# EAGLE design balise (EAGLE 8.6.0)
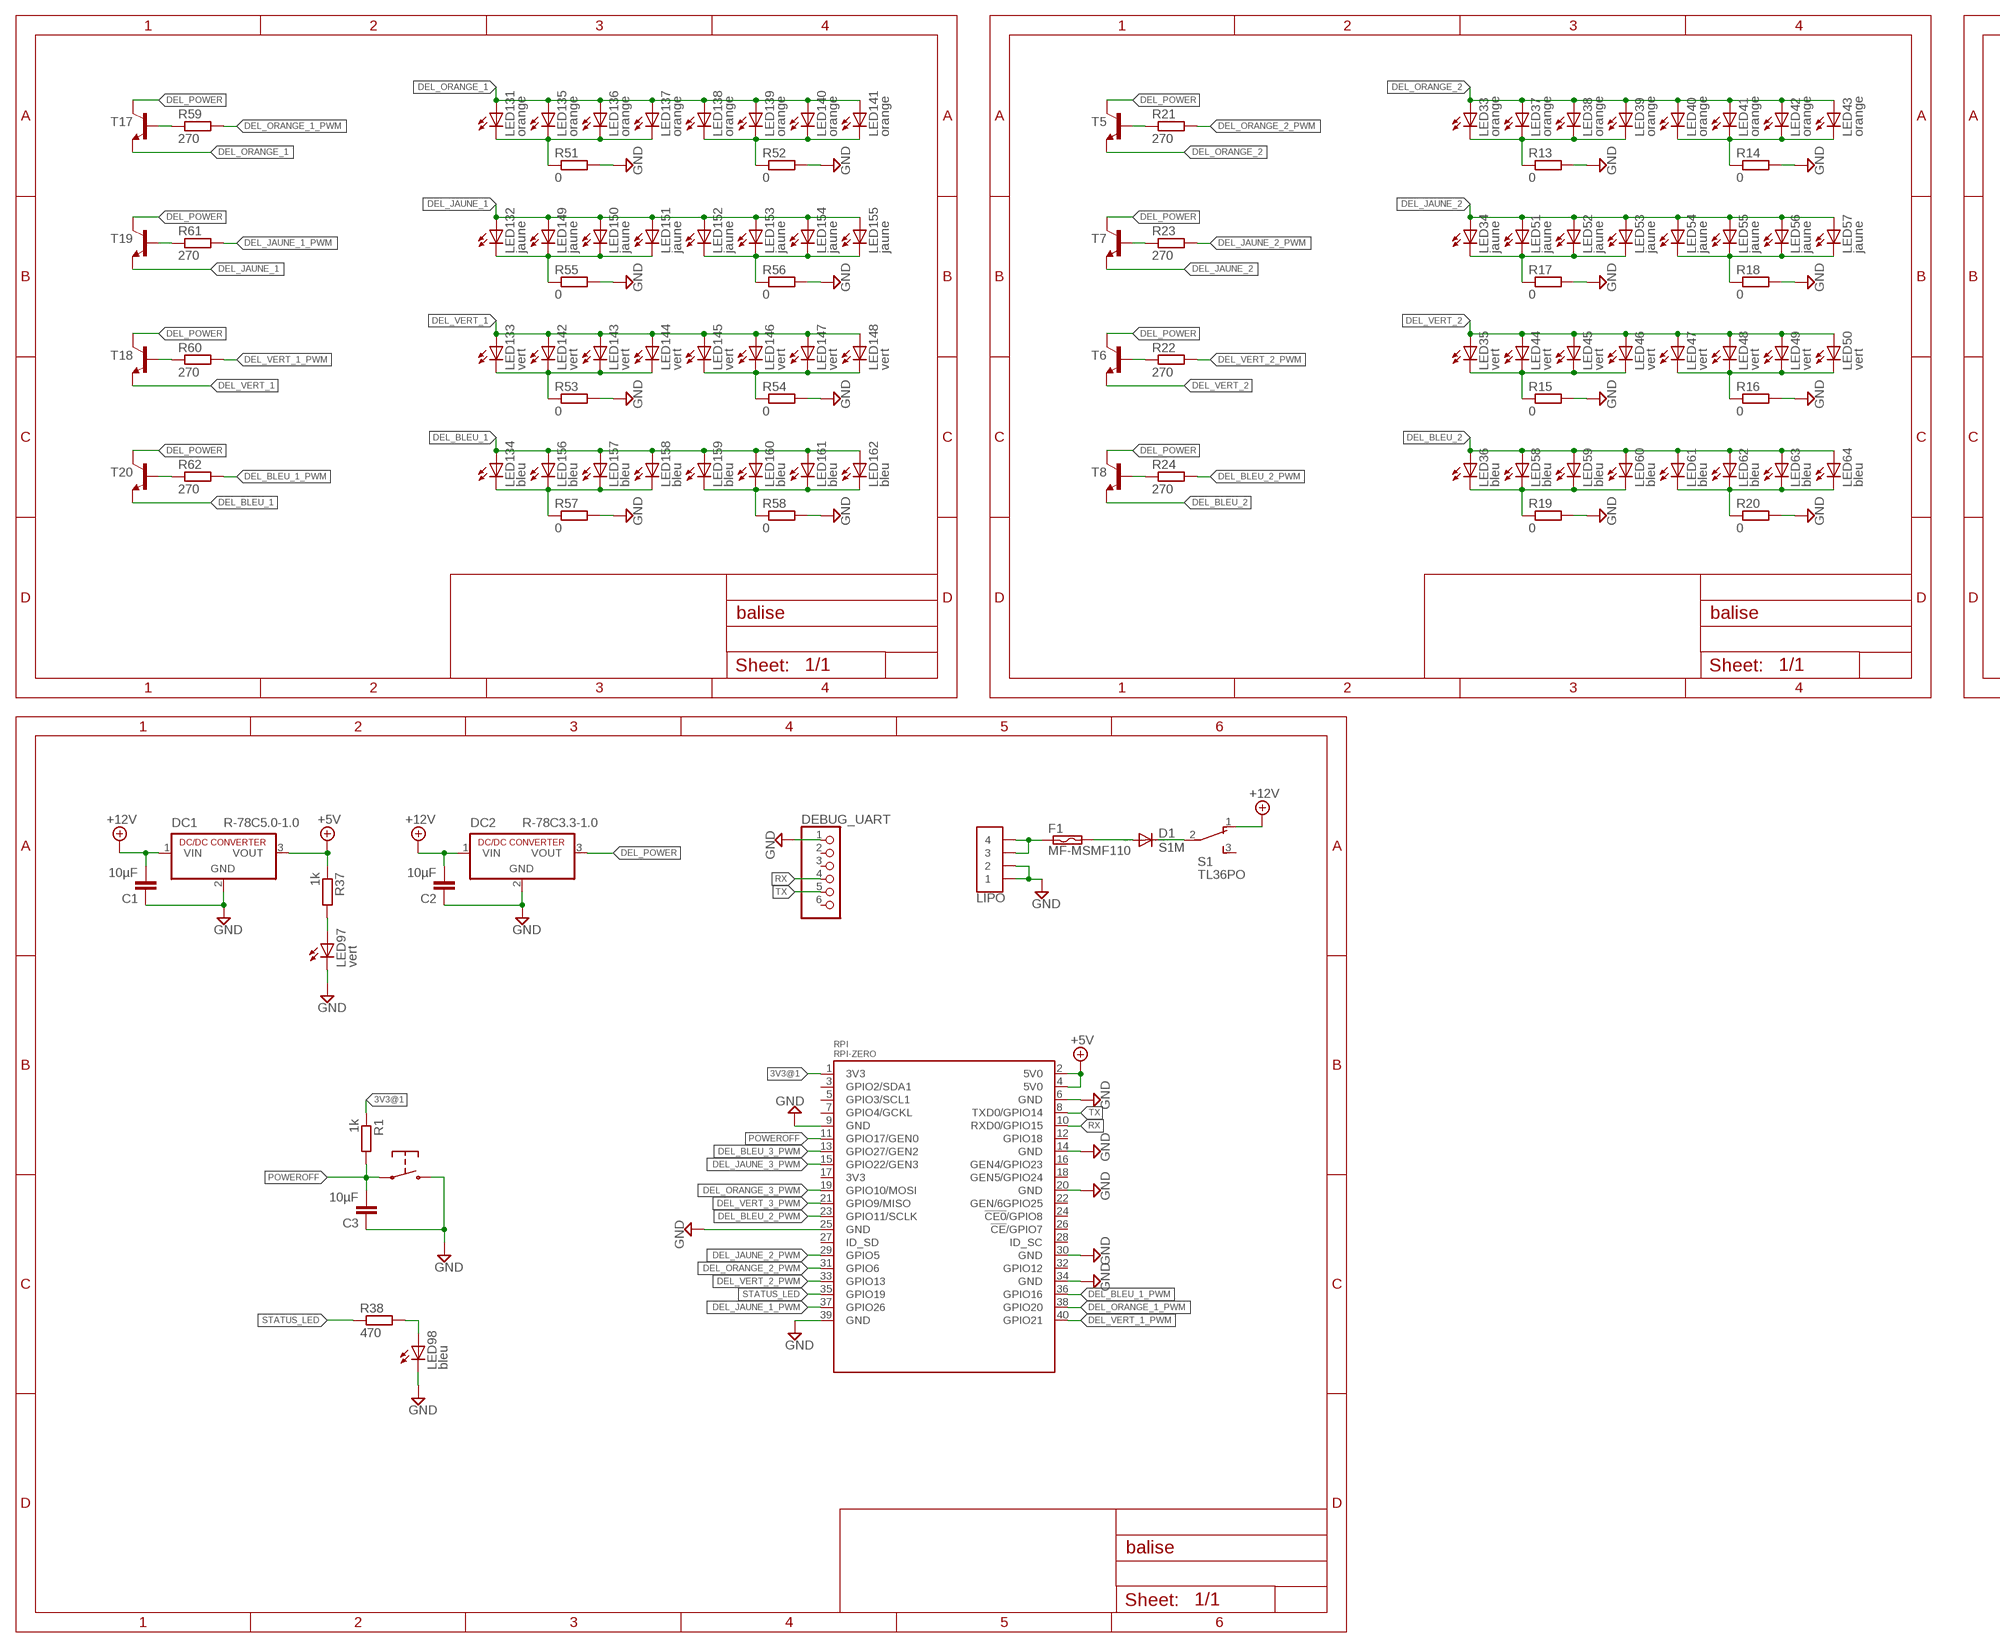
[diagram p0: schematic, sheet 1, part 1 of 2]
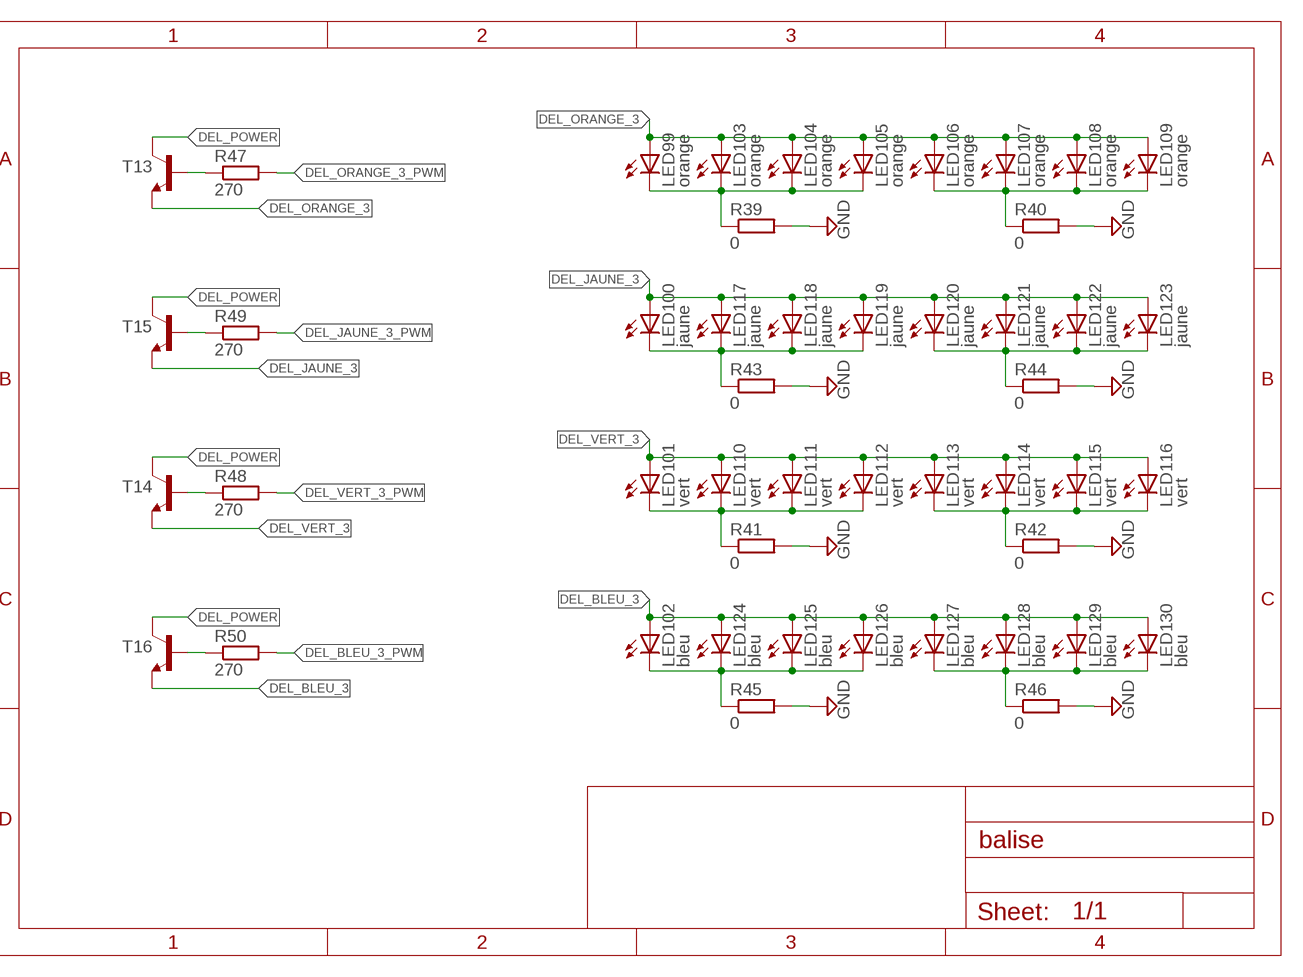
[diagram p1: schematic, sheet 1, part 2 of 2]

## Parts
C1  10µF  C-EUC0805  [C0805]
C2  10µF  C-EUC0805  [C0805]
C3  10µF  C-EUC0805  [C0805]
D1  S1M  [SMA]
DC1  R-78C5.0-1.0  [SIP3]
DC2  R-78C3.3-1.0  [SIP3]
DEBUG_UART  PINHD-1X6  [1X06]
F1  MF-MSMF110  [MF-MSMF110]
LED33  orange  LED5MM  [LED5MM]
LED34  jaune  LED5MM  [LED5MM]
LED35  vert  LED5MM  [LED5MM]
LED36  bleu  LED5MM  [LED5MM]
LED37  orange  LED5MM  [LED5MM]
LED38  orange  LED5MM  [LED5MM]
LED39  orange  LED5MM  [LED5MM]
LED40  orange  LED5MM  [LED5MM]
LED41  orange  LED5MM  [LED5MM]
LED42  orange  LED5MM  [LED5MM]
LED43  orange  LED5MM  [LED5MM]
LED44  vert  LED5MM  [LED5MM]
LED45  vert  LED5MM  [LED5MM]
LED46  vert  LED5MM  [LED5MM]
LED47  vert  LED5MM  [LED5MM]
LED48  vert  LED5MM  [LED5MM]
LED49  vert  LED5MM  [LED5MM]
LED50  vert  LED5MM  [LED5MM]
LED51  jaune  LED5MM  [LED5MM]
LED52  jaune  LED5MM  [LED5MM]
LED53  jaune  LED5MM  [LED5MM]
LED54  jaune  LED5MM  [LED5MM]
LED55  jaune  LED5MM  [LED5MM]
LED56  jaune  LED5MM  [LED5MM]
LED57  jaune  LED5MM  [LED5MM]
LED58  bleu  LED5MM  [LED5MM]
LED59  bleu  LED5MM  [LED5MM]
LED60  bleu  LED5MM  [LED5MM]
LED61  bleu  LED5MM  [LED5MM]
LED62  bleu  LED5MM  [LED5MM]
LED63  bleu  LED5MM  [LED5MM]
LED64  bleu  LED5MM  [LED5MM]
LED97  vert  LED5MM  [LED5MM]
LED98  bleu  LED5MM  [LED5MM]
LED99  orange  LED5MM  [LED5MM]
LED100  jaune  LED5MM  [LED5MM]
LED101  vert  LED5MM  [LED5MM]
LED102  bleu  LED5MM  [LED5MM]
LED103  orange  LED5MM  [LED5MM]
LED104  orange  LED5MM  [LED5MM]
LED105  orange  LED5MM  [LED5MM]
LED106  orange  LED5MM  [LED5MM]
LED107  orange  LED5MM  [LED5MM]
LED108  orange  LED5MM  [LED5MM]
LED109  orange  LED5MM  [LED5MM]
LED110  vert  LED5MM  [LED5MM]
LED111  vert  LED5MM  [LED5MM]
LED112  vert  LED5MM  [LED5MM]
LED113  vert  LED5MM  [LED5MM]
LED114  vert  LED5MM  [LED5MM]
LED115  vert  LED5MM  [LED5MM]
LED116  vert  LED5MM  [LED5MM]
LED117  jaune  LED5MM  [LED5MM]
LED118  jaune  LED5MM  [LED5MM]
LED119  jaune  LED5MM  [LED5MM]
LED120  jaune  LED5MM  [LED5MM]
LED121  jaune  LED5MM  [LED5MM]
LED122  jaune  LED5MM  [LED5MM]
LED123  jaune  LED5MM  [LED5MM]
LED124  bleu  LED5MM  [LED5MM]
LED125  bleu  LED5MM  [LED5MM]
LED126  bleu  LED5MM  [LED5MM]
LED127  bleu  LED5MM  [LED5MM]
LED128  bleu  LED5MM  [LED5MM]
LED129  bleu  LED5MM  [LED5MM]
LED130  bleu  LED5MM  [LED5MM]
LED131  orange  LED5MM  [LED5MM]
LED132  jaune  LED5MM  [LED5MM]
LED133  vert  LED5MM  [LED5MM]
LED134  bleu  LED5MM  [LED5MM]
LED135  orange  LED5MM  [LED5MM]
LED136  orange  LED5MM  [LED5MM]
LED137  orange  LED5MM  [LED5MM]
LED138  orange  LED5MM  [LED5MM]
LED139  orange  LED5MM  [LED5MM]
LED140  orange  LED5MM  [LED5MM]
LED141  orange  LED5MM  [LED5MM]
LED142  vert  LED5MM  [LED5MM]
LED143  vert  LED5MM  [LED5MM]
LED144  vert  LED5MM  [LED5MM]
LED145  vert  LED5MM  [LED5MM]
LED146  vert  LED5MM  [LED5MM]
LED147  vert  LED5MM  [LED5MM]
LED148  vert  LED5MM  [LED5MM]
LED149  jaune  LED5MM  [LED5MM]
LED150  jaune  LED5MM  [LED5MM]
LED151  jaune  LED5MM  [LED5MM]
LED152  jaune  LED5MM  [LED5MM]
LED153  jaune  LED5MM  [LED5MM]
LED154  jaune  LED5MM  [LED5MM]
LED155  jaune  LED5MM  [LED5MM]
LED156  bleu  LED5MM  [LED5MM]
LED157  bleu  LED5MM  [LED5MM]
LED158  bleu  LED5MM  [LED5MM]
LED159  bleu  LED5MM  [LED5MM]
LED160  bleu  LED5MM  [LED5MM]
LED161  bleu  LED5MM  [LED5MM]
LED162  bleu  LED5MM  [LED5MM]
LIPO  JST-04GH-V  [GH-04-V]
R1  1k  R-EU_R0805  [R0805]
R13  0  R-EU_R0805  [R0805]
R14  0  R-EU_R0805  [R0805]
R15  0  R-EU_R0805  [R0805]
R16  0  R-EU_R0805  [R0805]
R17  0  R-EU_R0805  [R0805]
R18  0  R-EU_R0805  [R0805]
R19  0  R-EU_R0805  [R0805]
R20  0  R-EU_R0805  [R0805]
R21  270  R-EU_R0805  [R0805]
R22  270  R-EU_R0805  [R0805]
R23  270  R-EU_R0805  [R0805]
R24  270  R-EU_R0805  [R0805]
R37  1k  R-EU_R0805  [R0805]
R38  470  R-EU_R0805  [R0805]
R39  0  R-EU_R0805  [R0805]
R40  0  R-EU_R0805  [R0805]
R41  0  R-EU_R0805  [R0805]
R42  0  R-EU_R0805  [R0805]
R43  0  R-EU_R0805  [R0805]
R44  0  R-EU_R0805  [R0805]
R45  0  R-EU_R0805  [R0805]
R46  0  R-EU_R0805  [R0805]
R47  270  R-EU_R0805  [R0805]
R48  270  R-EU_R0805  [R0805]
R49  270  R-EU_R0805  [R0805]
R50  270  R-EU_R0805  [R0805]
R51  0  R-EU_R0805  [R0805]
R52  0  R-EU_R0805  [R0805]
R53  0  R-EU_R0805  [R0805]
R54  0  R-EU_R0805  [R0805]
R55  0  R-EU_R0805  [R0805]
R56  0  R-EU_R0805  [R0805]
R57  0  R-EU_R0805  [R0805]
R58  0  R-EU_R0805  [R0805]
R59  270  R-EU_R0805  [R0805]
R60  270  R-EU_R0805  [R0805]
R61  270  R-EU_R0805  [R0805]
R62  270  R-EU_R0805  [R0805]
RPI  RPI-ZERO  [RASPBERRYPI_BASTELSTUBE_V13_RASPI_BOARD_B+_FULL]
S1  TL36PO  [TL3XPO]
T5  BC817-16-NPN-SOT23-BEC  [SOT23-BEC]
T6  BC817-16-NPN-SOT23-BEC  [SOT23-BEC]
T7  BC817-16-NPN-SOT23-BEC  [SOT23-BEC]
T8  BC817-16-NPN-SOT23-BEC  [SOT23-BEC]
T13  BC817-16-NPN-SOT23-BEC  [SOT23-BEC]
T14  BC817-16-NPN-SOT23-BEC  [SOT23-BEC]
T15  BC817-16-NPN-SOT23-BEC  [SOT23-BEC]
T16  BC817-16-NPN-SOT23-BEC  [SOT23-BEC]
T17  BC817-16-NPN-SOT23-BEC  [SOT23-BEC]
T18  BC817-16-NPN-SOT23-BEC  [SOT23-BEC]
T19  BC817-16-NPN-SOT23-BEC  [SOT23-BEC]
T20  BC817-16-NPN-SOT23-BEC  [SOT23-BEC]
U$1  PUSH-BUTTON  [PUSH-BUTTON]

## Nets
3V3@1: R1.1 RPI.1(3V3)
+5V: DC1.3(VOUT) R37.1 RPI.2(5V0) RPI.4(5V0)
+12V: C1.2 C2.2 DC1.1(VIN) DC2.1(VIN) S1.1(O)
DEL_BLEU_1: LED134.A LED156.A LED157.A LED158.A LED159.A LED160.A LED161.A LED162.A T20.E
DEL_BLEU_1_PWM: R62.2 RPI.36(GPIO16)
DEL_BLEU_2: LED36.A LED58.A LED59.A LED60.A LED61.A LED62.A LED63.A LED64.A T8.E
DEL_BLEU_2_PWM: R24.2 RPI.23(GPIO11/SCLK)
DEL_BLEU_3: LED102.A LED124.A LED125.A LED126.A LED127.A LED128.A LED129.A LED130.A T16.E
DEL_BLEU_3_PWM: R50.2 RPI.13(GPIO27/GEN2)
DEL_JAUNE_1: LED132.A LED149.A LED150.A LED151.A LED152.A LED153.A LED154.A LED155.A T19.E
DEL_JAUNE_1_PWM: R61.2 RPI.37(GPIO26)
DEL_JAUNE_2: LED34.A LED51.A LED52.A LED53.A LED54.A LED55.A LED56.A LED57.A T7.E
DEL_JAUNE_2_PWM: R23.2 RPI.29(GPIO5)
DEL_JAUNE_3: LED100.A LED117.A LED118.A LED119.A LED120.A LED121.A LED122.A LED123.A T15.E
DEL_JAUNE_3_PWM: R49.2 RPI.15(GPIO22/GEN3)
DEL_ORANGE_1: LED131.A LED135.A LED136.A LED137.A LED138.A LED139.A LED140.A LED141.A T17.E
DEL_ORANGE_1_PWM: R59.2 RPI.38(GPIO20)
DEL_ORANGE_2: LED33.A LED37.A LED38.A LED39.A LED40.A LED41.A LED42.A LED43.A T5.E
DEL_ORANGE_2_PWM: R21.2 RPI.31(GPIO6)
DEL_ORANGE_3: LED99.A LED103.A LED104.A LED105.A LED106.A LED107.A LED108.A LED109.A T13.E
DEL_ORANGE_3_PWM: R47.2 RPI.19(GPIO10/MOSI)
DEL_POWER: DC2.3(VOUT) T5.C T6.C T7.C T8.C T13.C T14.C T15.C T16.C T17.C T18.C T19.C T20.C
DEL_VERT_1: LED133.A LED142.A LED143.A LED144.A LED145.A LED146.A LED147.A LED148.A T18.E
DEL_VERT_1_PWM: R60.2 RPI.40(GPIO21)
DEL_VERT_2: LED35.A LED44.A LED45.A LED46.A LED47.A LED48.A LED49.A LED50.A T6.E
DEL_VERT_2_PWM: R22.2 RPI.33(GPIO13)
DEL_VERT_3: LED101.A LED110.A LED111.A LED112.A LED113.A LED114.A LED115.A LED116.A T14.E
DEL_VERT_3_PWM: R48.2 RPI.21(GPIO9/MISO)
GND: C1.1 C2.1 C3.1 DC1.2(GND) DC2.2(GND) DEBUG_UART.1 LED97.K(C) LED98.K(C) LIPO.1 LIPO.2 R13.2 R14.2 R15.2 R16.2 R17.2 R18.2 R19.2 R20.2 R39.2 R40.2 R41.2 R42.2 R43.2 R44.2 R45.2 R46.2 R51.2 R52.2 R53.2 R54.2 R55.2 R56.2 R57.2 R58.2 RPI.6(GND) RPI.9(GND) RPI.14(GND) RPI.20(GND) RPI.25(GND) RPI.30(GND) RPI.34(GND) RPI.39(GND) U$1.3 U$1.4
N$1: F1.1 LIPO.3 LIPO.4
N$2: D1.A F1.2
N$4: D1.C S1.2(P)
N$6: LED33.K(C) LED37.K(C) LED38.K(C) LED39.K(C) R13.1
N$8: LED40.K(C) LED41.K(C) LED42.K(C) LED43.K(C) R14.1
N$9: LED35.K(C) LED44.K(C) LED45.K(C) LED46.K(C) R15.1
N$11: LED47.K(C) LED48.K(C) LED49.K(C) LED50.K(C) R16.1
N$12: LED34.K(C) LED51.K(C) LED52.K(C) LED53.K(C) R17.1
N$13: LED54.K(C) LED55.K(C) LED56.K(C) LED57.K(C) R18.1
N$14: LED36.K(C) LED58.K(C) LED59.K(C) LED60.K(C) R19.1
N$15: LED61.K(C) LED62.K(C) LED63.K(C) LED64.K(C) R20.1
N$18: R21.1 T5.B
N$20: R22.1 T6.B
N$21: R23.1 T7.B
N$23: R24.1 T8.B
N$40: LED97.A R37.2
N$42: LED98.A R38.2
N$43: LED99.K(C) LED103.K(C) LED104.K(C) LED105.K(C) R39.1
N$44: LED106.K(C) LED107.K(C) LED108.K(C) LED109.K(C) R40.1
N$45: LED101.K(C) LED110.K(C) LED111.K(C) LED112.K(C) R41.1
N$46: LED113.K(C) LED114.K(C) LED115.K(C) LED116.K(C) R42.1
N$47: LED100.K(C) LED117.K(C) LED118.K(C) LED119.K(C) R43.1
N$48: LED120.K(C) LED121.K(C) LED122.K(C) LED123.K(C) R44.1
N$49: LED102.K(C) LED124.K(C) LED125.K(C) LED126.K(C) R45.1
N$50: LED127.K(C) LED128.K(C) LED129.K(C) LED130.K(C) R46.1
N$51: R47.1 T13.B
N$52: R48.1 T14.B
N$53: R49.1 T15.B
N$54: R50.1 T16.B
N$55: LED131.K(C) LED135.K(C) LED136.K(C) LED137.K(C) R51.1
N$56: LED138.K(C) LED139.K(C) LED140.K(C) LED141.K(C) R52.1
N$57: LED133.K(C) LED142.K(C) LED143.K(C) LED144.K(C) R53.1
N$58: LED145.K(C) LED146.K(C) LED147.K(C) LED148.K(C) R54.1
N$59: LED132.K(C) LED149.K(C) LED150.K(C) LED151.K(C) R55.1
N$60: LED152.K(C) LED153.K(C) LED154.K(C) LED155.K(C) R56.1
N$61: LED134.K(C) LED156.K(C) LED157.K(C) LED158.K(C) R57.1
N$62: LED159.K(C) LED160.K(C) LED161.K(C) LED162.K(C) R58.1
N$63: R59.1 T17.B
N$64: R60.1 T18.B
N$65: R61.1 T19.B
N$66: R62.1 T20.B
POWEROFF: C3.2 R1.2 RPI.11(GPIO17/GEN0) U$1.1 U$1.2
RX: DEBUG_UART.4 RPI.10(RXD0/GPIO15)
STATUS_LED: R38.1 RPI.35(GPIO19)
TX: DEBUG_UART.5 RPI.8(TXD0/GPIO14)
Unconnected: DEBUG_UART.2 DEBUG_UART.3 DEBUG_UART.6 RPI.3(GPIO2/SDA1) RPI.5(GPIO3/SCL1) RPI.7(GPIO4/GCKL) RPI.12(GPIO18) RPI.16(GEN4/GPIO23) RPI.17(3V3) RPI.18(GEN5/GPIO24) RPI.22(GEN/6GPIO25) RPI.24(!CE0!/GPIO8) RPI.26(!CE!/GPIO7) RPI.27(ID_SD) RPI.28(ID_SC) RPI.32(GPIO12) S1.3(S)

## Library data of the parts
C1-C3 = resistor:C-EU: CAPACITOR, European symbol
D1 = diode:S1M; RS: 872-2874
DC1 DC2 = dc-dc-converter:R-78C*-1.0: INNOLINE DC/DC-Converter 1.0 AMP SIP3 Single Output Source: Data sheet <http://www.mikrocontroller.net/attachment/150645/157764-da-01-en-DC_DC_WANDLER_R_78C5_0_1_0.pdf>
DEBUG_UART = pinhead:PINHD-1X6: PIN HEADER
F1 = polyswitch:MF-MSMF110; RS: 647-8207
LED33-LED64 LED97-LED162 = led:LED: LED OSRAM: - CHIPLED LG R971, LG N971, LY N971, LG Q971, LY Q971, LO R971, LY R971 LH N974, LH R974 LS Q976, LO Q976, LY Q976 LO Q996 - Hyper CHIPLED LW Q18S LB Q993, LB Q99A, LB R99A - SideLED LS A670, LO A670, LY A670, LG A670, LP A670 LB A673, LV A673, LT A673, LW A673 LH A674 LY A675 LS A676, LA A676, LO A676, LY A676, LW A676 LS A679, LY A679, LG A679 - Hyper Micro SIDELED® LS Y876, LA Y876, LO Y876, LY Y876 LT Y87S - SmartLED LW L88C, LW L88S LB L89C, LB L89S, LG L890 LS L89K, LO L89K, LY L89K LS L896, LA L896, LO L896, LY L896 - TOPLED LS T670, LO T670, LY T670, LG T670, LP T670 LSG T670, LSP T670, LSY T670, LOP T670, LYG T670 LG T671, LOG T671, LSG T671 LB T673, LV T673, LT T673, LW T673 LH T674 LS T676, LA T676, LO T676, LY T676, LB T676, LH T676, LSB T676, LW T676 LB T67C, LV T67C, LT T67C, LS T67K, LO T67K, LY T67K, LW E67C LS E67B, LA E67B, LO E67B, LY E67B, LB E67C, LV E67C, LT E67C LW T67C LS T679, LY T679, LG T679 LS T770, LO T770, LY T770, LG T770, LP T770 LB T773, LV T773, LT T773, LW T773 LH T774 LS E675, LA E675, LY E675, LS T675 LS T776, LA T776, LO T776, LY T776, LB T776 LHGB T686 LT T68C, LB T68C - Hyper Mini TOPLED® LB M676 - Mini TOPLED Santana® LG M470 LS M47K, LO M47K, LY M47K Source: http://www.osram.convergy.de LUXEON: - LUMILED® LXK2-PW12-R00, LXK2-PW12-S00, LXK2-PW14-U00, LXK2-PW14-V00 LXK2-PM12-R00, LXK2-PM12-S00, LXK2-PM14-U00 LXK2-PE12-Q00, LXK2-PE12-R00, LXK2-PE12-S00, LXK2-PE14-T00, LXK2-PE14-U00 LXK2-PB12-K00, LXK2-PB12-L00, LXK2-PB12-M00, LXK2-PB14-N00, LXK2-PB14-P00, LXK2-PB14-Q00 LXK2-PR12-L00, LXK2-PR12-M00, LXK2-PR14-Q00, LXK2-PR14-R00 LXK2-PD12-Q00, LXK2-PD12-R00, LXK2-PD12-S00 LXK2-PH12-R00, LXK2-PH12-S00 LXK2-PL12-P00, LXK2-PL12-Q00, LXK2-PL12-R00 Source: www.luxeon.com KINGBRIGHT: KA-3528ASYC Source: www.kingbright.com
LIPO = con-jst:JST-04
R1 R13-R24 R37-R62 = resistor:R-EU_: RESISTOR, European symbol
RPI = RPI-Zero:RPI-ZERO
S1 = switch:TL36PO: TINY SWITCH ON - ON Source: http://www2.produktinfo.conrad.com/datenblaetter/700000-724999/705152-da-01-de-Subminiaturschalter_TL_36YO.pdf; RS: 913-9069
T5-T8 T13-T20 = transistor:*-NPN-: NPN Transistror BF959 corrected 2008.03.06; RS: 781-4272
U$1 = push-button:PUSH-BUTTON; RS: 479-1491

## Board
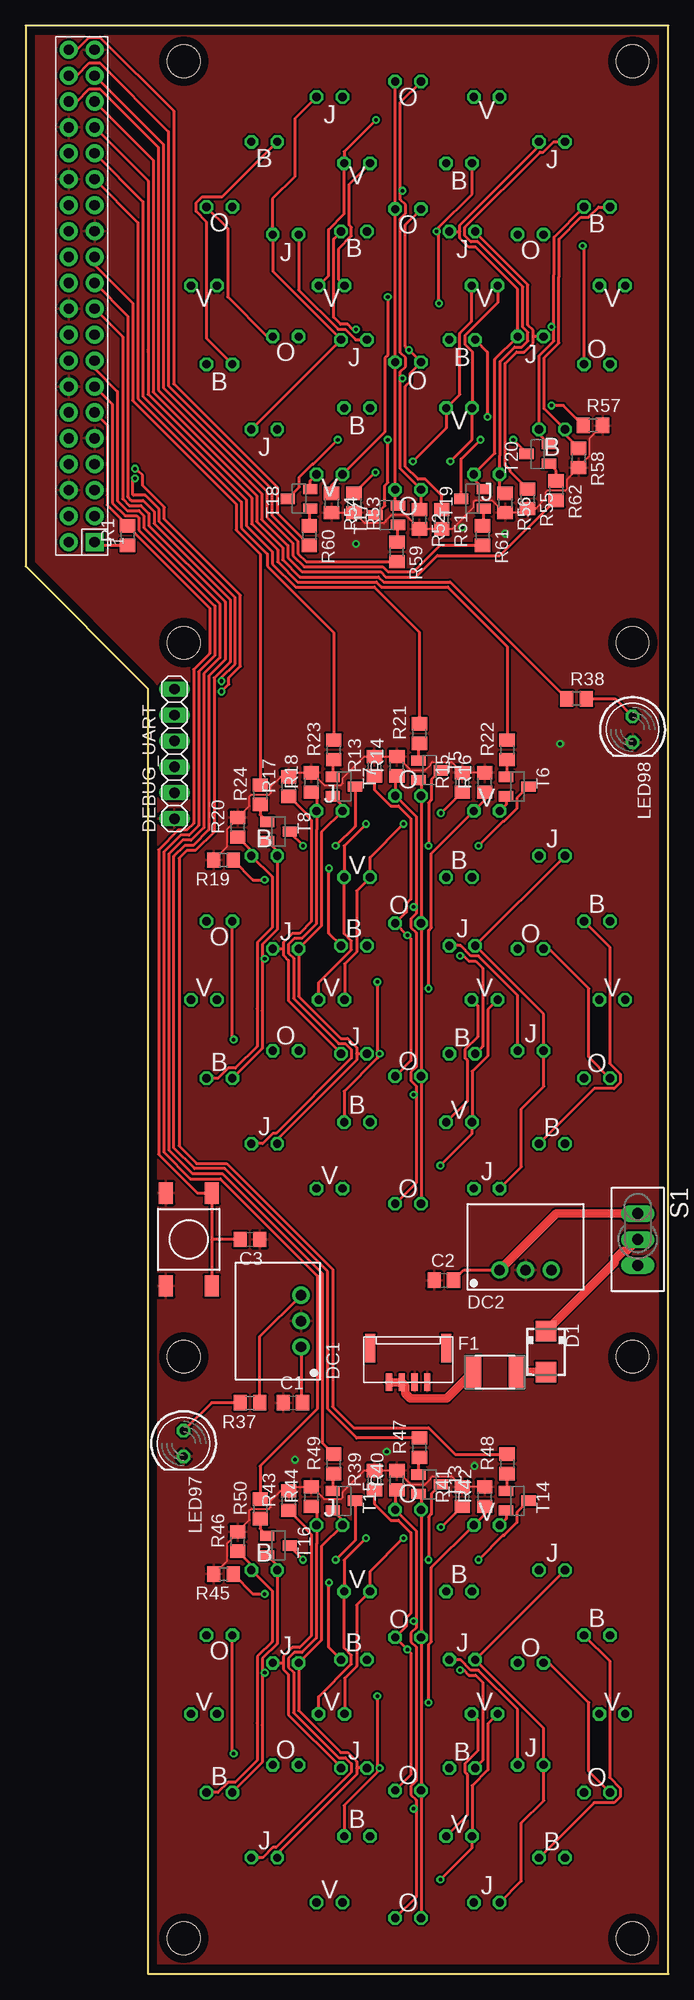
[diagram p2: board, top side]
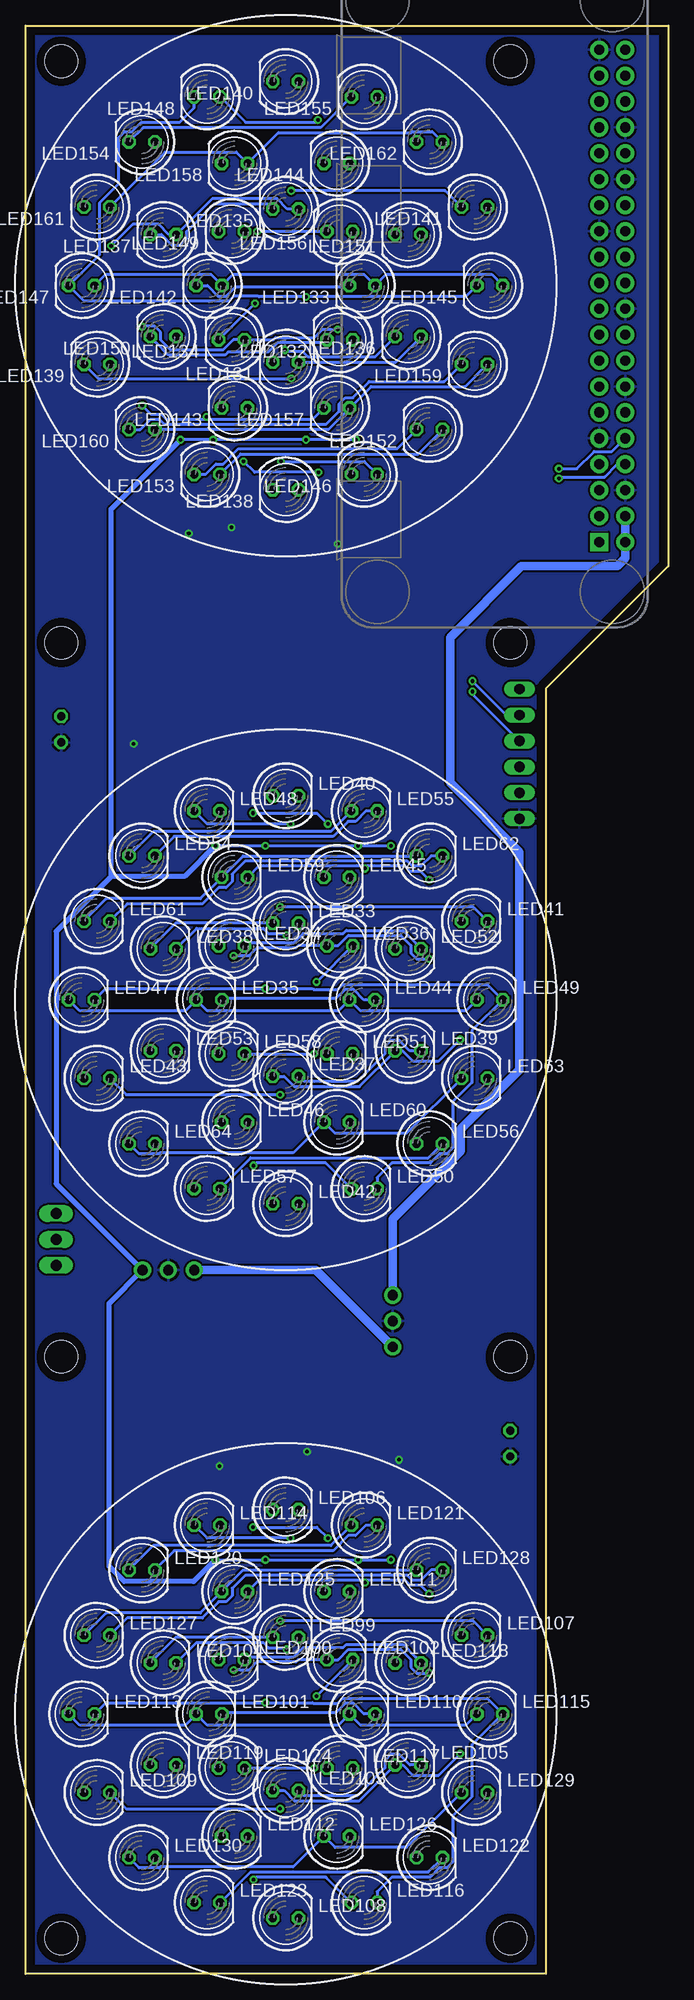
[diagram p3: board, bottom side, seen from below]

Size 63 x 191 mm. Coordinates in mm from the lower left corner, seen from the top.
Outline: 12,0 63,0 63,191 0,191 0,138 12,126 12,0
Copper layers (1*16): Top 0.035mm / dielectric 1.5mm / Bottom 0.035mm
Design rules "sg_default": minimum track width 0.2mm, minimum drill 0.35mm, track to track 0.2mm, track to pad 0.2mm, pad to pad 0.2mm, via to via 0.2mm, smd to smd 0.2mm, copper to edge 0.8mm, drill to drill 0.2mm, minimum pad ring 10mil, minimum via ring 8mil, stop-mask expansion 4mil, vias tented up to drill 1mm, thermal gap 10mil
Holes 3.2 mm at 15.5,187.5 59.5,187.5 15.5,3.5 59.5,3.5 15.5,60.5 59.5,60.5 15.5,130.5 59.5,130.5

### Footprints (pad centres in the part's own frame; a part is rotated, then mirrored left to right if it is on the bottom)
C0805 = smd 1.3 x 1.5: 1 -0.95,0; 2 0.95,0
SMA = smd 2 x 2: A 2,0; C -2,0
SIP3 = drill 1 pad 1.676: 1 -2.54,0; 2 0,0; 3 2.54,0
1X06 = drill 1.016 long: 1 -6.35,0; 2 -3.81,0; 3 -1.27,0; 4 1.27,0; 5 3.81,0; 6 6.35,0
MF-MSMF110 = smd 1.5 x 3.2: 1 -2.1,0; 2 2.1,0
LED5MM = drill 0.813 octagon: A -1.27,0; K 1.27,0
GH-04-V = smd 0.6 x 1.7: 1 -1.875,2.5; 2 -0.625,2.5; 3 0.625,2.5; 4 1.875,2.5 | smd 1 x 2.8: CASE0 3.725,-0.85; CASE1 -3.725,-0.85
R0805 = smd 1.3 x 1.5: 1 -0.95,0; 2 0.95,0
RASPBERRYPI_BASTELSTUBE_V13_RASPI_BOARD_B+_FULL = drill 1 pad 1.778 square: 1 8.37,25.23 | drill 1 pad 1.778: 2 8.37,27.77; 3 10.91,25.23; 4 10.91,27.77; 5 13.45,25.23; 6 13.45,27.77; 7 15.99,25.23; 8 15.99,27.77; 9 18.53,25.23; 10 18.53,27.77; 11 21.07,25.23; 12 21.07,27.77; 13 23.61,25.23; 14 23.61,27.77; 15 26.15,25.23; 16 26.15,27.77; 17 28.69,25.23; 18 28.69,27.77; 19 31.23,25.23; 20 31.23,27.77; 21 33.77,25.23; 22 33.77,27.77; 23 36.31,25.23; 24 36.31,27.77; 25 38.85,25.23; 26 38.85,27.77; 27 41.39,25.23; 28 41.39,27.77; 29 43.93,25.23; 30 43.93,27.77; 31 46.47,25.23; 32 46.47,27.77; 33 49.01,25.23; 34 49.01,27.77; 35 51.55,25.23; 36 51.55,27.77; 37 54.09,25.23; 38 54.09,27.77; 39 56.63,25.23; 40 56.63,27.77
TL3XPO = drill 1.1 pad 1.422 long: 1 -2.54,0; 2 0,0; 3 2.54,0
SOT23-BEC = smd 1 x 1.4: B -0.95,-1.1; C 0,1.1; E 0.95,-1.1
PUSH-BUTTON = smd 1.4 x 2.1: 1 2.25,4.55; 2 2.25,-4.55; 3 -2.25,4.55; 4 -2.25,-4.55

### Placement (x,y rotation side)
C1  26.2,56 0 top
C2  41,68 0 top
C3  22,72 180 top
D1  51,61 270 top
DC1  27,64 90 top
DC2  49,69 0 top
DEBUG_UART  14.6,119.6 90 top
F1  46,59 0 top
LED33  37.5,103 0 bottom
LED34  42.8,100.8 0 bottom
LED35  45,95.5 0 bottom
LED36  32.2,100.8 0 bottom
LED37  37.5,88 0 bottom
LED38  49.5,100.5 0 bottom
LED39  25.5,90.5 0 bottom
LED40  37.5,115.5 0 bottom
LED41  19,103.2 0 bottom
LED42  37.5,75.5 0 bottom
LED43  56,87.8 0 bottom
LED44  30,95.5 0 bottom
LED45  32.5,107.5 0 bottom
LED46  42.5,83.5 0 bottom
LED47  57.5,95.5 0 bottom
LED48  45.2,114 0 bottom
LED49  17.5,95.5 0 bottom
LED50  29.8,77 0 bottom
LED51  32.2,90.2 0 bottom
LED52  25.5,100.5 0 bottom
LED53  49.5,90.5 0 bottom
LED54  51.6,109.6 0 bottom
LED55  29.8,114 0 bottom
LED56  23.4,81.4 0 bottom
LED57  45.2,77 0 bottom
LED58  42.8,90.2 0 bottom
LED59  42.5,107.5 0 bottom
LED60  32.5,83.5 0 bottom
LED61  56,103.2 0 bottom
LED62  23.4,109.6 0 bottom
LED63  19,87.8 0 bottom
LED64  51.6,81.4 0 bottom
LED97  15.5,52 270 top
LED98  59.5,122 270 top
LED99  37.5,33 0 bottom
LED100  42.8,30.8 0 bottom
LED101  45,25.5 0 bottom
LED102  32.2,30.8 0 bottom
LED103  37.5,18 0 bottom
LED104  49.5,30.5 0 bottom
LED105  25.5,20.5 0 bottom
LED106  37.5,45.5 0 bottom
LED107  19,33.2 0 bottom
LED108  37.5,5.5 0 bottom
LED109  56,17.8 0 bottom
LED110  30,25.5 0 bottom
LED111  32.5,37.5 0 bottom
LED112  42.5,13.5 0 bottom
LED113  57.5,25.5 0 bottom
LED114  45.2,44 0 bottom
LED115  17.5,25.5 0 bottom
LED116  29.8,7 0 bottom
LED117  32.2,20.2 0 bottom
LED118  25.5,30.5 0 bottom
LED119  49.5,20.5 0 bottom
LED120  51.6,39.6 0 bottom
LED121  29.8,44 0 bottom
LED122  23.4,11.4 0 bottom
LED123  45.2,7 0 bottom
LED124  42.8,20.2 0 bottom
LED125  42.5,37.5 0 bottom
LED126  32.5,13.5 0 bottom
LED127  56,33.2 0 bottom
LED128  23.4,39.6 0 bottom
LED129  19,17.8 0 bottom
LED130  51.6,11.4 0 bottom
LED131  37.5,158 180 bottom
LED132  32.2,160.2 180 bottom
LED133  30,165.5 180 bottom
LED134  42.8,160.2 180 bottom
LED135  37.5,173 180 bottom
LED136  25.5,160.5 180 bottom
LED137  49.5,170.5 180 bottom
LED138  37.5,145.5 180 bottom
LED139  56,157.8 180 bottom
LED140  37.5,185.5 180 bottom
LED141  19,173.2 180 bottom
LED142  45,165.5 180 bottom
LED143  42.5,153.5 180 bottom
LED144  32.5,177.5 180 bottom
LED145  17.5,165.5 180 bottom
LED146  29.8,147 180 bottom
LED147  57.5,165.5 180 bottom
LED148  45.2,184 180 bottom
LED149  42.8,170.8 180 bottom
LED150  49.5,160.5 180 bottom
LED151  25.5,170.5 180 bottom
LED152  23.4,151.4 180 bottom
LED153  45.2,147 180 bottom
LED154  51.6,179.6 180 bottom
LED155  29.8,184 180 bottom
LED156  32.2,170.8 180 bottom
LED157  32.5,153.5 180 bottom
LED158  42.5,177.5 180 bottom
LED159  19,157.8 180 bottom
LED160  51.6,151.4 180 bottom
LED161  56,173.2 180 bottom
LED162  23.4,179.6 180 bottom
LIPO  37.5,60.5 180 top
R1  10,141 90 top
R13  34.2,118.4 90 top
R14  36.4,118.4 90 top
R15  42.8,116.8 90 top
R16  45,116.8 90 top
R17  25.8,116.4 90 top
R18  28,116.8 90 top
R19  19.4,109.2 180 top
R20  20.8,112.4 90 top
R21  38.6,121.6 90 top
R22  47.2,120 90 top
R23  30.2,120 90 top
R24  23,115.6 90 top
R37  22,56 180 top
R38  54,125 0 top
R39  34.2,48.4 90 top
R40  36.4,48.4 90 top
R41  42.8,46.8 90 top
R42  45,46.8 90 top
R43  25.8,46.4 90 top
R44  28,46.8 90 top
R45  19.4,39.2 180 top
R46  20.8,42.4 90 top
R47  38.6,51.6 90 top
R48  47.2,50 90 top
R49  30.2,50 90 top
R50  23,45.6 90 top
R51  40.8,142.6 270 top
R52  38.6,142.6 270 top
R53  32.2,144.2 270 top
R54  30,144.2 270 top
R55  49.2,144.6 270 top
R56  47,144.2 270 top
R57  55.6,151.8 0 top
R58  54.2,148.6 270 top
R59  36.4,139.4 270 top
R60  27.8,141 270 top
R61  44.8,141 270 top
R62  52,145.4 270 top
RPI  32,132 90 top
S1  60,72 270 top
T5  39.6,118 270 top
T6  48.2,116.4 270 top
T7  31.2,116.4 270 top
T8  24.8,112 270 top
T13  39.6,48 270 top
T14  48.2,46.4 270 top
T15  31.2,46.4 270 top
T16  24.8,42 270 top
T17  35.4,143 90 top
T18  26.8,144.6 90 top
T19  43.8,144.6 90 top
T20  50.2,149 90 top
U$1  16,72 0 top

### Tracks (layer width: path | path; a pad name or v marks a point on that pad's centre or on a via)
3V3@1
  Top 0.3: RPI.1 7.09,140.05 R1.1
+5V
  Top 0.3: R37.1 22.95,62.49 DC1.3
  Bottom 0.813: DC1.3 27,74.03 20.36,80.67 20.36,82.84 14.6,88.6 14.6,110 21.4,116.8 21.4,131 14.4,138 5,138 4.23,138.77 RPI.2 RPI.4
+12V
  Top 0.3: DC1.1 27,56.15 C1.2 | C2.2 42.95,69 DC2.1
  Top 0.813: S1.1 52,74.54 DC2.1
  Bottom 0.813: DC1.1 34.54,69 DC2.1
DEL_BLEU_1  (via drill 0.35)
  Top 0.3: T20.E 50.33,150.92 LED160.A 50.33,158.63 51.78,160.08 51.78,161.4 | 51.78,161.4 51.78,166.58 51.8,166.6 51.8,170.27 LED161.A | v51.55,161.47 51.62,161.4 51.78,161.4 | v32.4,161.2 32.07,161.2 31.56,161.71 30.89,161.71 30.2,162.4 30.2,170.07 LED156.A
  Bottom 0.3: LED161.A 49.33,178.6 42.33,178.6 LED158.A 38.23,180.5 25.2,180.5 25.09,180.61 23.14,180.61 LED162.A | LED160.A 33.33,151.4 LED157.A 29.13,155.6 19.93,155.6 LED159.A | v51.55,161.47 51.51,161.51 50.35,161.51 49.76,160.92 49.76,160.16 48.79,159.19 43.65,159.19 42.64,160.2 LED134.A 38.71,160.2 38.49,160.41 34.69,160.41 33.89,161.21 33.05,161.21 33.04,161.2 v32.4,161.2
DEL_BLEU_1_PWM
  Top 0.3: RPI.36 5.02,183.55 6.26,184.79 7.28,184.79 13.01,179.06 13.01,155.27 23.15,145.13 23.15,142.58 25.7,140.03 25.7,138.84 27.09,137.45 34.8,137.45 35.3,136.95 38.26,136.95 40.36,139.05 46.49,139.05 51.9,144.45 R62.2
DEL_BLEU_2  (via drill 0.35)
  Top 0.3: T8.E 24.67,110.08 LED62.A 24.67,102.37 23.22,100.92 23.22,99.6 | 23.22,99.6 23.22,94.42 23.2,94.4 23.2,90.73 LED63.A | v23.45,99.53 23.38,99.6 23.22,99.6 | v42.6,99.8 42.93,99.8 43.44,99.29 44.11,99.29 44.8,98.6 44.8,90.93 LED58.A
  Bottom 0.3: LED63.A 25.67,82.4 32.67,82.4 LED60.A 36.77,80.5 49.8,80.5 49.91,80.39 51.86,80.39 LED64.A | LED62.A 41.67,109.6 LED59.A 45.87,105.4 55.07,105.4 LED61.A | v23.45,99.53 23.49,99.49 24.65,99.49 25.24,100.08 25.24,100.84 26.21,101.81 31.35,101.81 32.36,100.8 LED36.A 36.29,100.8 36.51,100.59 40.31,100.59 41.11,99.79 41.95,99.79 41.96,99.8 v42.6,99.8
DEL_BLEU_2_PWM
  Top 0.3: RPI.23 6.77,167.52 10.51,163.78 10.51,154.23 20.65,144.09 20.65,141.55 23,139.2 R24.2
DEL_BLEU_3  (via drill 0.35)
  Top 0.3: T16.E 24.67,40.08 LED128.A 24.67,32.37 23.22,30.92 23.22,29.6 | 23.22,29.6 23.22,24.42 23.2,24.4 23.2,20.73 LED129.A | v23.45,29.53 23.38,29.6 23.22,29.6 | v42.6,29.8 42.93,29.8 43.44,29.29 44.11,29.29 44.8,28.6 44.8,20.93 LED124.A
  Bottom 0.3: LED129.A 25.67,12.4 32.67,12.4 LED126.A 36.77,10.5 49.8,10.5 49.91,10.39 51.86,10.39 LED130.A | LED128.A 41.67,39.6 LED125.A 45.87,35.4 55.07,35.4 LED127.A | v23.45,29.53 23.49,29.49 24.65,29.49 25.24,30.08 25.24,30.84 26.21,31.81 31.35,31.81 32.36,30.8 LED102.A 36.29,30.8 36.51,30.59 40.31,30.59 41.11,29.79 41.95,29.79 41.96,29.8 v42.6,29.8
DEL_BLEU_3_PWM
  Top 0.3: RPI.13 8.51,153.87 8.51,144.2 9.76,142.95 10.89,142.95 11.1,142.75 11.1,141.56 18.55,134.11 18.55,129.24 16.97,127.66 16.97,112.58 16.03,111.64 15.2,111.64 13.55,109.99 13.55,80.56 16.16,77.95 19.09,77.95 28.6,68.44 28.6,55.4 23,49.8 R50.2
DEL_JAUNE_1
  Top 0.3: T19.E 43.93,146.52 LED153.A 46,149.07 46,158.27 LED150.A 48.23,165.17 44.11,169.29 43.44,169.29 42.56,170.17 42.56,170.8 | LED155.A 26.4,181.87 26.4,176.2 24.2,174 24.2,170.53 LED151.A 24.23,166.9 LED132.A LED152.A | LED154.A 50.33,179.2 42.56,171.43 42.56,170.8 | LED149.A 42.56,170.8
  Bottom 0.3: LED153.A 41.93,149 24.53,149 LED152.A
DEL_JAUNE_1_PWM
  Top 0.3: RPI.37 13.51,179.35 13.51,155.48 23.65,145.34 23.65,142.79 26.2,140.24 26.2,139.05 27.3,137.95 35,137.95 35.5,137.45 38.05,137.45 40.65,140.05 R61.2
DEL_JAUNE_2
  Top 0.3: T7.E 31.07,114.48 LED55.A 29,111.93 29,102.73 LED52.A 26.77,95.83 30.89,91.71 31.56,91.71 32.44,90.83 32.44,90.2 | LED57.A 48.6,79.13 48.6,84.8 50.8,87 50.8,90.47 LED53.A 50.77,94.1 LED34.A LED54.A | LED56.A 24.67,81.8 32.44,89.57 32.44,90.2 | LED51.A 32.44,90.2
  Bottom 0.3: LED55.A 33.07,112 50.47,112 LED54.A
DEL_JAUNE_2_PWM
  Top 0.3: RPI.29 11.01,171.69 11.01,154.44 21.15,144.3 21.15,141.75 23.7,139.21 23.7,138.01 30.2,131.51 R23.2
DEL_JAUNE_3
  Top 0.3: T15.E 31.07,44.48 LED121.A 29,41.93 29,32.73 LED118.A 26.77,25.83 30.89,21.71 31.56,21.71 32.44,20.83 32.44,20.2 | LED123.A 48.6,9.13 48.6,14.8 50.8,17 50.8,20.47 LED119.A 50.77,24.1 LED100.A LED120.A | LED122.A 24.67,11.8 32.44,19.57 32.44,20.2 | LED117.A 32.44,20.2
  Bottom 0.3: LED121.A 33.07,42 50.47,42 LED120.A
DEL_JAUNE_3_PWM
  Top 0.3: RPI.15 6.77,157.36 9.01,155.12 9.01,144.41 9.96,143.45 11.1,143.45 11.6,142.95 11.6,141.76 19.05,134.31 19.05,129.03 17.47,127.45 17.47,112.38 16.24,111.14 15.4,111.14 14.05,109.79 14.05,80.76 16.36,78.45 19.3,78.45 29.1,68.65 29.1,52.05 R49.2
DEL_ORANGE_1  (via drill 0.35)
  Top 0.3: T17.E 36.23,144.22 LED138.A LED131.A LED135.A LED140.A | LED141.A 19.8,171.13 19.8,164.4 23.7,160.5 LED136.A | v54.6,169.4 54.73,169.27 LED139.A
  Bottom 0.3: LED131.A 26.73,158 LED136.A | LED135.A 37.34,173 38.35,174.01 44.72,174.01 LED137.A 48.95,170.5 49.96,171.51 52.49,171.51 v54.6,169.4
DEL_ORANGE_1_PWM
  Top 0.3: RPI.38 5.02,186.09 6.26,187.33 7.28,187.33 14.01,180.6 14.01,155.68 24.15,145.54 24.15,143 26.7,140.45 26.7,139.25 27.51,138.45 R59.2
DEL_ORANGE_2  (via drill 0.35)
  Top 0.3: T5.E 38.77,116.78 LED40.A LED33.A LED37.A LED42.A | LED43.A 55.2,89.87 55.2,96.6 51.3,100.5 LED38.A | v20.4,91.6 20.27,91.73 LED41.A
  Bottom 0.3: LED33.A 48.27,103 LED38.A | LED37.A 37.66,88 36.65,86.99 30.28,86.99 LED39.A 26.05,90.5 25.04,89.49 22.51,89.49 v20.4,91.6
DEL_ORANGE_2_PWM
  Top 0.3: RPI.31 11.51,173.73 11.51,154.65 21.65,144.51 21.65,141.96 24.2,139.41 24.2,138.22 26.47,135.95 34.18,135.95 38.6,131.53 R21.2
DEL_ORANGE_3  (via drill 0.35)
  Top 0.3: T13.E 38.77,46.78 LED106.A LED99.A LED103.A LED108.A | LED109.A 55.2,19.87 55.2,26.6 51.3,30.5 LED104.A | v20.4,21.6 20.27,21.73 LED107.A
  Bottom 0.3: LED99.A 48.27,33 LED104.A | LED103.A 37.66,18 36.65,16.99 30.28,16.99 LED105.A 26.05,20.5 25.04,19.49 22.51,19.49 v20.4,21.6
DEL_ORANGE_3_PWM
  Top 0.3: RPI.19 9.51,160.49 9.51,144.61 10.17,143.95 11.31,143.95 12.1,143.16 12.1,141.97 19.55,134.52 19.55,128.82 17.97,127.25 17.97,112.17 16.44,110.64 15.61,110.64 14.55,109.58 14.55,80.97 16.57,78.95 19.51,78.95 29.6,68.86 29.6,55.4 32.45,52.55 R47.2
DEL_POWER  (via drill 0.35)
  Top 0.3: v35.5,150.4 35.5,146.2 35.22,145.92 35.22,143.92 T17.C | v47.8,150.4 49.1,149.1 T20.C | T19.C 42.7,148.5 v44.6,150.4 | T18.C 26.85,145.75 26.85,146.75 28.11,148.01 28.21,148.01 v30.6,150.4 | v39.5,110.6 39.5,114.8 39.78,115.08 39.78,117.08 T5.C | v27.2,110.6 25.9,111.9 T8.C | T7.C 32.3,112.5 v30.4,110.6 | T6.C 48.15,115.25 48.15,114.25 46.89,112.99 46.79,112.99 v44.4,110.6 | v39.5,40.6 39.5,44.8 39.78,45.08 39.78,47.08 T13.C | v27.2,40.6 25.9,41.9 T16.C | T15.C 32.3,42.5 v30.4,40.6 | T14.C 48.15,45.25 48.15,44.25 46.89,42.99 46.79,42.99 v44.4,40.6
  Bottom 0.3: v47.8,150.4 v44.6,150.4 v35.5,150.4 v30.6,150.4 | v27.2,110.6 v30.4,110.6 v39.5,110.6 v44.4,110.6 | v27.2,40.6 v30.4,40.6 v39.5,40.6 v44.4,40.6
  Bottom 0.508: v44.4,40.6 46.51,38.49 53.33,38.49 54.8,39.95 54.8,65.74 DC2.3 60,77.46 60,102.2 54.6,107.6 | v44.4,110.6 47.4,107.6 54.6,107.6 | 54.6,107.6 54.6,143.6 v47.8,150.4
DEL_VERT_1  (via drill 0.35)
  Top 0.3: T18.E 27.9,146.37 LED146.A | LED133.A 29.7,166.47 29.7,171 31.23,172.53 LED144.A 31.23,178.63 v34.35,181.75 | LED142.A 43.73,162 42.56,160.83 42.56,154.83 LED143.A 41.23,151.54 v37.96,148.27
  Bottom 0.3: LED147.A 55.13,166.6 44.83,166.6 LED142.A 42.63,166.6 29.83,166.6 LED133.A 27.63,166.6 17.33,166.6 LED145.A | LED148.A 41.43,181.5 34.6,181.5 v34.35,181.75 | v37.96,148.27 29.8,148.27 LED146.A
DEL_VERT_1_PWM
  Top 0.3: RPI.40 5.02,188.63 6.26,189.87 7.28,189.87 14.51,182.64 14.51,155.89 24.65,145.75 24.65,143.21 R60.2
DEL_VERT_2  (via drill 0.35)
  Top 0.3: T6.E 47.1,114.63 LED48.A | LED35.A 45.3,94.53 45.3,90 43.77,88.47 LED46.A 43.77,82.37 v40.65,79.25 | LED44.A 31.27,99 32.44,100.17 32.44,106.17 LED45.A 33.77,109.46 v37.04,112.73
  Bottom 0.3: LED49.A 19.87,94.4 30.17,94.4 LED44.A 32.37,94.4 45.17,94.4 LED35.A 47.37,94.4 57.67,94.4 LED47.A | LED50.A 33.57,79.5 40.4,79.5 v40.65,79.25 | v37.04,112.73 45.2,112.73 LED48.A
DEL_VERT_2_PWM
  Top 0.3: RPI.33 12.01,175.77 12.01,159.2 12.01,159 12.01,154.85 22.15,144.71 22.15,142.17 24.7,139.62 24.7,138.43 26.68,136.45 34.38,136.45 34.88,135.95 41.39,135.95 47.2,130.14 R22.2
DEL_VERT_3  (via drill 0.35)
  Top 0.3: T14.E 47.1,44.63 LED114.A | LED101.A 45.3,24.53 45.3,20 43.77,18.47 LED112.A 43.77,12.37 v40.65,9.25 | LED110.A 31.27,29 32.44,30.17 32.44,36.17 LED111.A 33.77,39.46 v37.04,42.73
  Bottom 0.3: LED115.A 19.87,24.4 30.17,24.4 LED110.A 32.37,24.4 45.17,24.4 LED101.A 47.37,24.4 57.67,24.4 LED113.A | LED116.A 33.57,9.5 40.4,9.5 v40.65,9.25 | v37.04,42.73 45.2,42.73 LED114.A
DEL_VERT_3_PWM
  Top 0.3: RPI.21 10.01,162.53 10.01,144.82 10.38,144.45 11.52,144.45 12.6,143.37 12.6,142.18 20.05,134.73 20.05,128.62 18.47,127.04 18.47,111.96 16.65,110.14 15.82,110.14 15.05,109.37 15.05,81.18 16.78,79.45 19.72,79.45 30.1,69.07 30.1,55.61 32.16,53.55 39.5,53.55 42.09,50.95 R48.2
GND  (via drill 0.35)
  Top 0.2: R57.2 55.25,150.5 55.25,148.78 54.2,147.73 R58.2 53.05,146.5 53.05,145.58 52.87,145.4 51.13,145.4 50.95,145.22 50.95,144.6 50,143.65 R55.2 48.8,143.25 R56.2 46.92,143.25 45.72,144.45 44.08,144.45 43.9,144.27 43.9,143.75 41.8,141.65 R51.2 R52.2 37.25,143 35.83,143 35.3,142.47 35.3,142.38 35.12,142.2 33.25,142.2 R53.2 R54.2 | R19.2 19.75,110.5 19.75,112.22 20.8,113.27 R20.2 21.95,114.5 21.95,115.42 22.13,115.6 23.87,115.6 24.05,115.78 24.05,116.4 25,117.35 R17.2 26.2,117.75 R18.2 28.08,117.75 29.28,116.55 30.92,116.55 31.1,116.73 31.1,117.25 33.2,119.35 R13.2 R14.2 37.75,118 39.17,118 39.7,118.53 39.7,118.62 39.88,118.8 41.75,118.8 R15.2 R16.2 | R45.2 19.75,40.5 19.75,42.22 20.8,43.27 R46.2 21.95,44.5 21.95,45.42 22.13,45.6 23.87,45.6 24.05,45.78 24.05,46.4 25,47.35 R43.2 26.2,47.75 R44.2 28.08,47.75 29.28,46.55 30.92,46.55 31.1,46.73 31.1,47.25 33.2,49.35 R39.2 R40.2 37.75,48 39.17,48 39.7,48.53 39.7,48.62 39.88,48.8 41.75,48.8 R41.2 R42.2
  other vias: 26.4,50.4 35.4,51.2 44,49.8 52.4,120.6 32.4,140.2 42.8,141.8 47,141.2
  pour Top: 0,191 63,191 63,0 12,0 12,126 0,138
  pour Bottom: 0,191 63,191 63,0 12,0 12,126 0,138
N$1
  Top 0.813: LIPO.4 LIPO.3 37.22,57.66 37.22,56.9 37.72,56.4 41.3,56.4 F1.1
N$2
  Top 0.813: F1.2 D1.A
N$4
  Top 0.813: D1.C 57.74,69.74 57.74,70.05 58.58,70.89 58.89,70.89 S1.2
N$6  (via drill 0.35)
  Top 0.3: R13.1 34.2,116.1 35.81,114.49 36.53,114.49 37.77,113.25 37.77,105.36 37.31,104.9 37.31,104.08 LED33.K v37.41,101.81 37.77,101.46 37.77,89.54 LED37.K
  Bottom 0.3: LED38.K 46.23,102.5 39.7,102.5 39.19,101.99 37.59,101.99 v37.41,101.81 | LED39.K 25.34,90.5 26.35,91.51 27.19,91.51 27.78,90.92 27.78,90.2 30.49,87.49 35.72,87.49 LED37.K
N$8  (via drill 0.35)
  Top 0.3: R14.1 36.23,117.28 LED40.K 38.27,113.46 38.27,104.6 | 38.27,104.6 38.27,103.93 37.76,103.42 37.76,102.58 38.27,102.07 38.27,88.93 37.76,88.42 37.76,87.58 38.27,87.07 38.27,86.2 | LED42.K 38.27,77.54 38.27,86.2 | v38.04,86.2 38.27,86.2 | v38.04,104.6 38.27,104.6
  Bottom 0.3: LED43.K 53.13,86.2 v38.04,86.2 | LED41.K 19.13,104.6 v38.04,104.6
N$9  (via drill 0.35)
  Top 0.3: LED35.K 44.3,94.93 44.3,91.86 43.06,90.62 43.06,89.78 43.27,89.57 43.27,85.54 LED46.K | LED44.K 28.73,97.17 31.94,100.38 31.94,101.26 31.23,101.97 LED45.K 31.23,110.59 v33.37,112.73 | R15.1 40.75,113.8 v40.7,113.8
  Bottom 0.3: LED44.K 29.84,95.5 30.85,96.51 31.69,96.51 32.6,95.6 43.63,95.6 LED35.K | v40.7,113.8 34.44,113.8 v33.37,112.73
N$11  (via drill 0.35)
  Top 0.3: R16.1 45,115.07 LED48.K 39.78,109.85 39.78,102.58 39.5,102.3 v39.5,96.6
  Bottom 0.3: LED50.K 28.53,78.07 27.1,79.5 23.32,79.5 22.43,80.39 21.71,80.39 21.12,80.98 21.12,85.52 19.26,87.38 19.26,92.47 LED49.K 17.74,97.01 31.9,97.01 32.39,96.52 34.78,96.52 34.86,96.6 v39.5,96.6 55.13,96.6 LED47.K
N$12
  Top 0.3: R17.1 27.52,113.73 27.52,113.58 28,113.1 28,103.14 26.87,102.01 26.14,102.01 25.26,101.13 25.26,100.6 | 25.26,100.6 25.26,99.87 25.77,99.36 25.77,95.42 30.93,90.26 LED51.K | LED52.K 25.16,100.5 25.26,100.6 | LED53.K 48.23,95.93 44.37,99.79 43.65,99.79 42.64,100.8 LED34.K
  Bottom 0.3: LED34.K 41.24,101.09 36.71,101.09 35.8,102 31.87,102 31.56,102.31 26,102.31 24.74,101.05 24.74,101.01 LED52.K
N$13
  Top 0.3: R18.1 28.53,115.32 LED55.K 28.53,112.17 28.5,112.14 28.5,102.94 27.07,101.51 26.35,101.51 25.76,100.92 25.76,100.08 26.27,99.57 26.27,95.62 30.68,91.21 31.35,91.21 31.94,90.62 31.94,89.78 24.57,82.41 24.25,82.41 23.24,81.4 LED56.K
  Bottom 0.3: LED55.K 29.64,114 30.65,112.99 31.37,112.99 32.86,111.5 48.43,111.5 LED54.K | LED57.K 40.93,80 23.53,80 LED56.K
N$14  (via drill 0.35)
  Top 0.3: R19.1 22.29,107.26 v23.44,107.26 | LED36.K 29.73,102 v29.73,108.37 | v34.48,97.25 34.48,90.2 | 34.48,90.2 34.48,89.78 31.23,86.53 LED60.K | v34.71,90.2 34.48,90.2
  Bottom 0.3: v23.44,107.26 24.27,108.09 25.3,108.09 25.81,108.6 29.8,108.6 | LED59.K 40.13,108.6 29.8,108.6 | v29.73,108.37 29.73,108.53 29.8,108.6 | LED58.K v34.71,90.2 | LED36.K v34.48,97.25
N$15
  Top 0.3: R20.1 22.13,110.12 LED62.K 24.17,107.56 24.17,102.58 22.72,101.13 22.72,94.63 22.7,94.61 22.7,90.94 20.57,88.81 19.85,88.81 18.84,87.8 LED63.K | LED61.K 57.24,100.69 57.24,89.26 58.28,88.22 58.28,87.38 57.69,86.79 55.72,86.79 LED64.K
  Bottom 0.3: LED62.K 23.24,109.6 24.25,108.59 25.09,108.59 25.6,109.1 41.46,109.1 42.76,107.8 42.76,107.08 43.35,106.49 44.07,106.49 45.66,104.9 53.03,104.9 LED61.K
N$18
  Top 0.3: R21.1 38.5,120.55 T5.B
N$20
  Top 0.3: T6.B 47.2,117.45 R22.1
N$21
  Top 0.3: R23.1 30.1,118.95 T7.B
N$23
  Top 0.3: R24.1 23,113.65 T8.B
N$40
  Top 0.3: R37.2 18.23,56 LED97.A
N$42
  Top 0.3: R38.2 57.77,125 LED98.A
N$43  (via drill 0.35)
  Top 0.3: R39.1 34.2,46.1 35.81,44.49 36.53,44.49 37.77,43.25 37.77,35.36 37.31,34.9 37.31,34.08 LED99.K v37.41,31.82 37.77,31.46 37.77,19.54 LED103.K
  Bottom 0.3: LED104.K 46.23,32.5 39.7,32.5 39.19,31.99 37.59,31.99 v37.41,31.82 | LED105.K 25.34,20.5 26.35,21.51 27.19,21.51 27.78,20.92 27.78,20.2 30.49,17.49 35.72,17.49 LED103.K
N$44  (via drill 0.35)
  Top 0.3: R40.1 36.23,47.28 LED106.K 38.27,43.46 38.27,34.6 | 38.27,34.6 38.27,33.93 37.76,33.42 37.76,32.58 38.27,32.07 38.27,18.93 37.76,18.42 37.76,17.58 38.27,17.07 38.27,16.2 | LED108.K 38.27,7.54 38.27,16.2 | v38.04,16.2 38.27,16.2 | v38.04,34.6 38.27,34.6
  Bottom 0.3: LED109.K 53.13,16.2 v38.04,16.2 | LED107.K 19.13,34.6 v38.04,34.6
N$45  (via drill 0.35)
  Top 0.3: LED101.K 44.3,24.93 44.3,21.86 43.06,20.62 43.06,19.78 43.27,19.57 43.27,15.54 LED112.K | LED110.K 28.73,27.17 31.94,30.38 31.94,31.26 31.23,31.97 LED111.K 31.23,40.59 v33.37,42.73 | R41.1 40.75,43.8 v40.7,43.8
  Bottom 0.3: LED110.K 29.84,25.5 30.85,26.51 31.69,26.51 32.6,25.6 43.63,25.6 LED101.K | v40.7,43.8 34.44,43.8 v33.37,42.73
N$46  (via drill 0.35)
  Top 0.3: R42.1 45,45.07 LED114.K 39.78,39.85 39.78,32.58 39.5,32.3 v39.5,26.6
  Bottom 0.3: LED116.K 28.53,8.07 27.1,9.5 23.32,9.5 22.43,10.39 21.71,10.39 21.12,10.98 21.12,15.52 19.26,17.38 19.26,22.47 LED115.K 17.74,27.01 31.9,27.01 32.39,26.52 34.78,26.52 34.86,26.6 v39.5,26.6 55.13,26.6 LED113.K
N$47
  Top 0.3: R43.1 27.52,43.73 27.52,43.58 28,43.1 28,33.14 26.87,32.01 26.14,32.01 25.26,31.13 25.26,30.6 | 25.26,30.6 25.26,29.87 25.77,29.36 25.77,25.42 30.93,20.26 LED117.K | LED118.K 25.16,30.5 25.26,30.6 | LED119.K 48.23,25.93 44.37,29.79 43.65,29.79 42.64,30.8 LED100.K
  Bottom 0.3: LED100.K 41.24,31.09 36.71,31.09 35.8,32 31.87,32 31.56,32.31 26,32.31 24.74,31.05 24.74,31.01 LED118.K
N$48
  Top 0.3: R44.1 28.53,45.32 LED121.K 28.53,42.17 28.5,42.14 28.5,32.94 27.07,31.51 26.35,31.51 25.76,30.92 25.76,30.08 26.27,29.57 26.27,25.62 30.68,21.21 31.35,21.21 31.94,20.62 31.94,19.78 24.57,12.41 24.25,12.41 23.24,11.4 LED122.K
  Bottom 0.3: LED121.K 29.64,44 30.65,42.99 31.37,42.99 32.86,41.5 48.43,41.5 LED120.K | LED123.K 40.93,10 23.53,10 LED122.K
N$49  (via drill 0.35)
  Top 0.3: R45.1 22.29,37.26 v23.44,37.26 | LED102.K 29.73,32 v29.73,38.37 | v34.48,27.25 34.48,20.2 | 34.48,20.2 34.48,19.78 31.23,16.53 LED126.K | v34.71,20.2 34.48,20.2
  Bottom 0.3: v23.44,37.26 24.27,38.09 25.3,38.09 25.81,38.6 29.8,38.6 | LED125.K 40.13,38.6 29.8,38.6 | v29.73,38.37 29.73,38.53 29.8,38.6 | LED124.K v34.71,20.2 | LED102.K v34.48,27.25
N$50
  Top 0.3: R46.1 22.13,40.12 LED128.K 24.17,37.56 24.17,32.58 22.72,31.13 22.72,24.63 22.7,24.61 22.7,20.94 20.57,18.81 19.85,18.81 18.84,17.8 LED129.K | LED127.K 57.24,30.69 57.24,19.26 58.28,18.22 58.28,17.38 57.69,16.79 55.72,16.79 LED130.K
  Bottom 0.3: LED128.K 23.24,39.6 24.25,38.59 25.09,38.59 25.6,39.1 41.46,39.1 42.76,37.8 42.76,37.08 43.35,36.49 44.07,36.49 45.66,34.9 53.03,34.9 LED127.K
N$51
  Top 0.3: R47.1 38.5,50.55 T13.B
N$52
  Top 0.3: T14.B 47.2,47.45 R48.1
N$53
  Top 0.3: R49.1 30.1,48.95 T15.B
N$54
  Top 0.3: R50.1 23,43.65 T16.B
N$55  (via drill 0.35)
  Top 0.3: R51.1 40.8,144.9 39.19,146.51 38.47,146.51 37.23,147.75 37.23,155.64 37.69,156.1 37.69,156.92 LED131.K v37.59,159.19 37.23,159.54 37.23,171.46 LED135.K
  Bottom 0.3: LED136.K 28.77,158.5 35.3,158.5 35.81,159.01 37.41,159.01 v37.59,159.19 | LED137.K 49.66,170.5 48.65,169.49 47.81,169.49 47.22,170.08 47.22,170.8 44.51,173.51 39.28,173.51 LED135.K
N$56  (via drill 0.35)
  Top 0.3: R52.1 38.77,143.72 LED138.K 36.73,147.54 36.73,156.4 | 36.73,156.4 36.73,157.07 37.24,157.58 37.24,158.42 36.73,158.93 36.73,172.07 37.24,172.58 37.24,173.42 36.73,173.93 36.73,174.8 | LED140.K 36.73,183.46 36.73,174.8 | v36.96,174.8 36.73,174.8 | v36.96,156.4 36.73,156.4
  Bottom 0.3: LED141.K 21.87,174.8 v36.96,174.8 | LED139.K 55.87,156.4 v36.96,156.4
N$57  (via drill 0.35)
  Top 0.3: LED133.K 30.7,166.07 30.7,169.14 31.94,170.38 31.94,171.22 31.73,171.43 31.73,175.46 LED144.K | LED142.K 46.27,163.83 43.06,160.62 43.06,159.74 43.77,159.03 LED143.K 43.77,150.41 v41.63,148.27 | R53.1 34.25,147.2 v34.3,147.2
  Bottom 0.3: LED142.K 45.16,165.5 44.15,164.49 43.31,164.49 42.4,165.4 31.37,165.4 LED133.K | v34.3,147.2 40.56,147.2 v41.63,148.27
N$58  (via drill 0.35)
  Top 0.3: R54.1 30,145.93 LED146.K 35.22,151.15 35.22,158.42 35.5,158.7 v35.5,164.4
  Bottom 0.3: LED148.K 46.47,182.93 47.9,181.5 51.68,181.5 52.57,180.61 53.29,180.61 53.88,180.02 53.88,175.48 55.74,173.62 55.74,168.53 LED147.K 57.26,163.99 43.1,163.99 42.61,164.48 40.22,164.48 40.14,164.4 v35.5,164.4 19.87,164.4 LED145.K
N$59
  Top 0.3: R55.1 47.48,147.27 47.48,147.42 47,147.9 47,157.86 48.13,158.99 48.86,158.99 49.74,159.87 49.74,160.4 | 49.74,160.4 49.74,161.13 49.23,161.64 49.23,165.58 44.07,170.74 LED149.K | LED150.K 49.84,160.5 49.74,160.4 | LED151.K 26.77,165.07 30.63,161.21 31.35,161.21 32.36,160.2 LED132.K
  Bottom 0.3: LED132.K 33.76,159.91 38.29,159.91 39.2,159 43.13,159 43.44,158.69 49,158.69 50.26,159.95 50.26,159.99 LED150.K
N$60
  Top 0.3: R56.1 46.47,145.68 LED153.K 46.47,148.83 46.5,148.86 46.5,158.06 47.93,159.49 48.65,159.49 49.24,160.08 49.24,160.92 48.73,161.43 48.73,165.38 44.32,169.79 43.65,169.79 43.06,170.38 43.06,171.22 50.43,178.59 50.75,178.59 51.76,179.6 LED154.K
  Bottom 0.3: LED153.K 45.36,147 44.35,148.01 43.63,148.01 42.14,149.5 26.57,149.5 LED152.K | LED155.K 34.07,181 51.47,181 LED154.K
N$61  (via drill 0.35)
  Top 0.3: R57.1 52.71,153.74 v51.56,153.74 | LED134.K 45.27,159 v45.27,152.63 | v40.52,163.75 40.52,170.8 | 40.52,170.8 40.52,171.22 43.77,174.47 LED158.K | v40.29,170.8 40.52,170.8
  Bottom 0.3: v51.56,153.74 50.73,152.91 49.7,152.91 49.19,152.4 45.2,152.4 | LED157.K 34.87,152.4 45.2,152.4 | v45.27,152.63 45.27,152.47 45.2,152.4 | LED156.K v40.29,170.8 | LED134.K v40.52,163.75
N$62
  Top 0.3: R58.1 52.87,150.88 LED160.K 50.83,153.44 50.83,158.42 52.28,159.87 52.28,166.37 52.3,166.39 52.3,170.06 54.43,172.19 55.15,172.19 56.16,173.2 LED161.K | LED159.K 17.76,160.31 17.76,171.74 16.72,172.78 16.72,173.62 17.31,174.21 19.28,174.21 LED162.K
  Bottom 0.3: LED160.K 51.76,151.4 50.75,152.41 49.91,152.41 49.4,151.9 33.54,151.9 32.24,153.2 32.24,153.92 31.65,154.51 30.93,154.51 29.34,156.1 21.97,156.1 LED159.K
N$63
  Top 0.3: R59.1 36.5,140.45 T17.B
N$64
  Top 0.3: T18.B 27.8,143.55 R60.1
N$65
  Top 0.3: R61.1 44.9,142.05 T19.B
N$66
  Top 0.3: R62.1 52,147.35 T20.B
POWEROFF
  Top 0.3: RPI.11 8.01,151.83 8.01,144.94 8,144.93 8,144 10,142 R1.2 18.05,133.9 18.05,129.44 16.47,127.87 16.47,112.79 15.82,112.14 14.99,112.14 13.05,110.2 13.05,80.35 16.85,76.55 U$1.1 18.25,72 | 18.25,72 U$1.2 | C3.2 18.25,72
RX  (via drill 0.35)
  Top 0.3: v19.2,125.71 19.93,126.44 19.93,127.08 21.05,128.2 21.05,135.14 13.6,142.59 13.6,143.78 11.46,145.91 11.46,146.9 11.04,147.33 10.96,147.33 v10.74,147.56
  Bottom 0.3: DEBUG_UART.4 19.2,125.47 v19.2,125.71 | v10.74,147.56 8.96,147.56 7.28,149.23 5.53,149.23 RPI.10
STATUS_LED
  Top 0.3: RPI.35 12.51,177.81 12.51,155.06 22.65,144.92 22.65,142.38 25.2,139.83 25.2,138.63 26.88,136.95 34.59,136.95 35.09,136.45 41.6,136.45 R38.1
TX  (via drill 0.35)
  Top 0.3: v19.2,126.74 19.2,127.06 20.55,128.41 20.55,134.94 13.1,142.39 13.1,143.57 11.72,144.95 10.59,144.95 10.51,145.03 10.51,146.37 v10.74,146.6
  Bottom 0.3: DEBUG_UART.5 15.88,123.41 v19.2,126.74 | RPI.8 5.02,147.99 6.26,146.75 10.59,146.75 v10.74,146.6

### Text on the board
tPlace: O | V | J | B | J | V | B | O | O | B | J | B | J | O | V | V | V | V | O | J | O | J | B | B | O | B | V | J | B | V | J | O | O | J | V | B | J | V | B | O | B | O | J | B | J | O | V | V | V | V | O | J | B | J | O | B | O | B | V | J | B | J | V | O | O | J | V | B | J | V | B | O | B | O | J | B | J | O | V | V | V | V | O | J | B | J | O | B | O | B | V | J | B | J | V | O